# EAGLE schematic untitled (EAGLE 8.6.3)
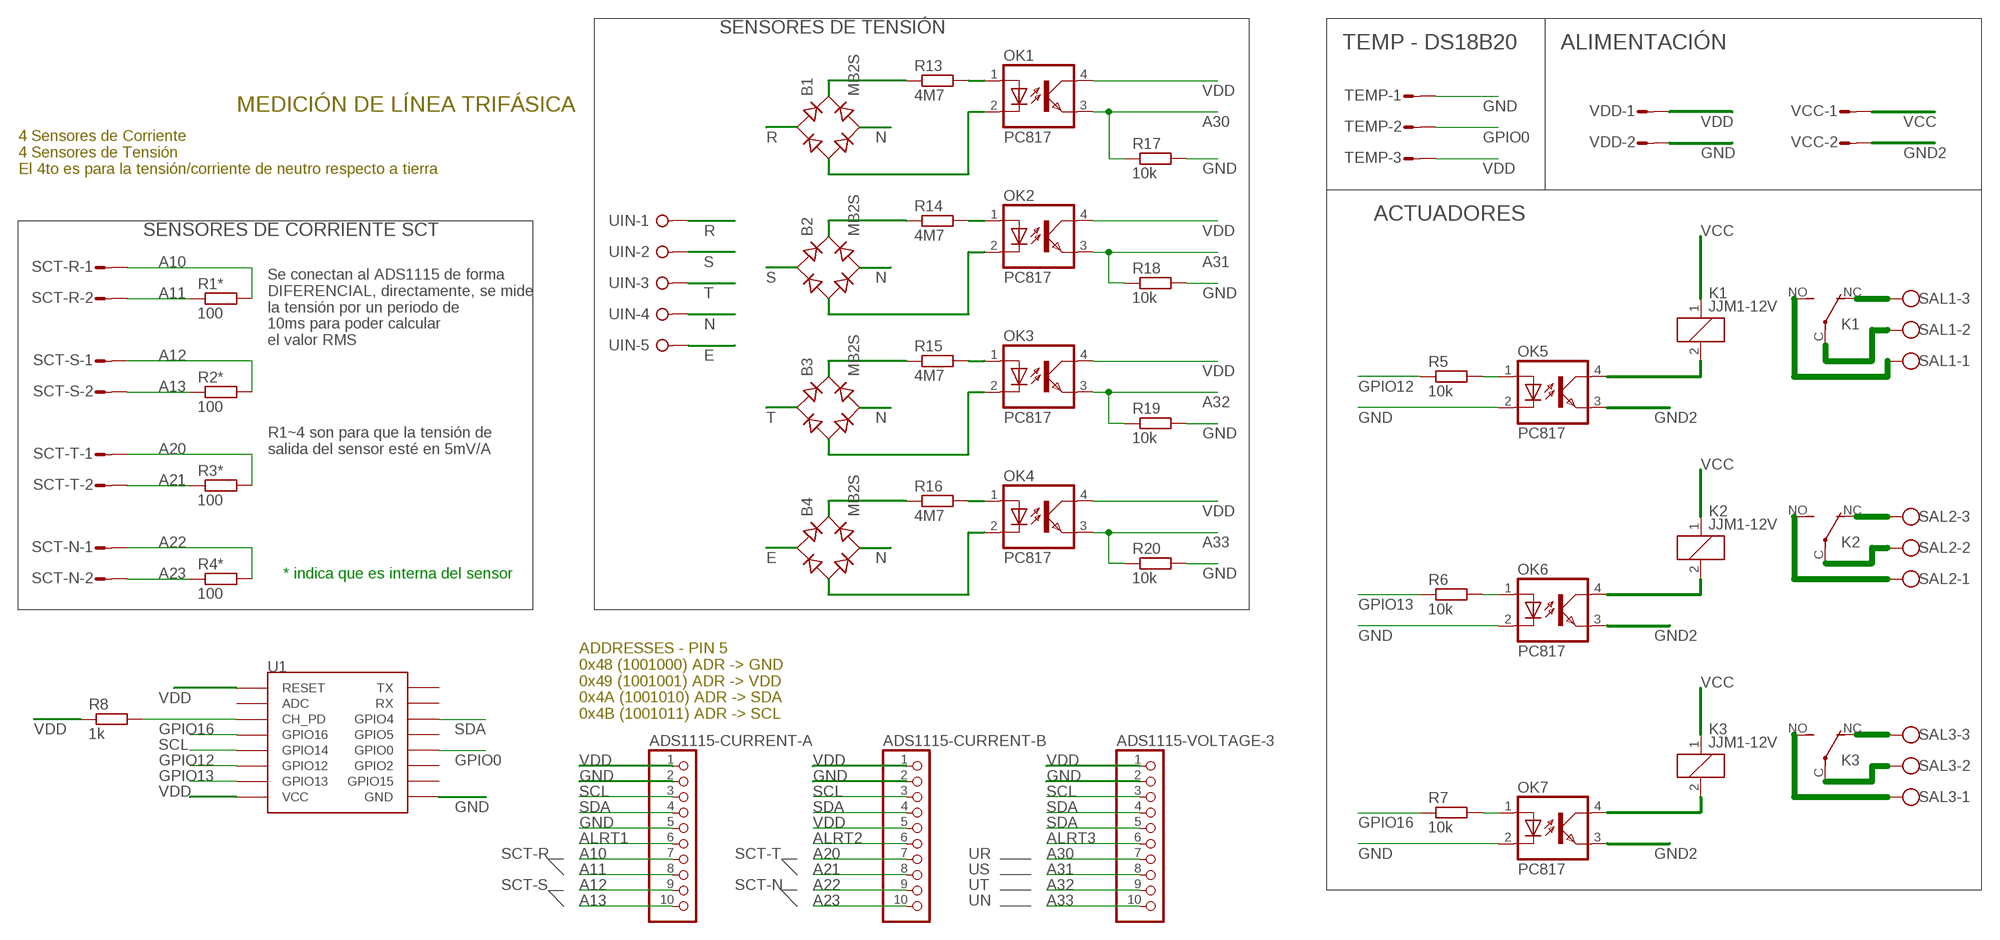
[diagram p0: schematic, sheet 1]

## Parts
ADS1115-CURRENT-A  PINHD-1X10  [1X10]
ADS1115-CURRENT-B  PINHD-1X10  [1X10]
ADS1115-VOLTAGE-3  PINHD-1X10  [1X10]
B1  MB2S  [SOIC-4]
B2  MB2S  [SOIC-4]
B3  MB2S  [SOIC-4]
B4  MB2S  [SOIC-4]
K1  JJM1-12V  [JJM1C]
K2  JJM1-12V  [JJM1C]
K3  JJM1-12V  [JJM1C]
OK1  PC817  [DIL04]
OK2  PC817  [DIL04]
OK3  PC817  [DIL04]
OK4  PC817  [DIL04]
OK5  PC817  [DIL04]
OK6  PC817  [DIL04]
OK7  PC817  [DIL04]
R1*  100  R-EU_M0805  [M0805]
R2*  100  R-EU_M0805  [M0805]
R3*  100  R-EU_M0805  [M0805]
R4*  100  R-EU_M0805  [M0805]
R5  10k  R-EU_M0805  [M0805]
R6  10k  R-EU_M0805  [M0805]
R7  10k  R-EU_M0805  [M0805]
R8  1k  R-EU_M0805  [M0805]
R13  4M7  R-EU_M0805  [M0805]
R14  4M7  R-EU_M0805  [M0805]
R15  4M7  R-EU_M0805  [M0805]
R16  4M7  R-EU_M0805  [M0805]
R17  10k  R-EU_M0805  [M0805]
R18  10k  R-EU_M0805  [M0805]
R19  10k  R-EU_M0805  [M0805]
R20  10k  R-EU_M0805  [M0805]
SAL1  W237-103  [W237-103]
SAL2  W237-103  [W237-103]
SAL3  W237-103  [W237-103]
SCT-N  S02P  [S02P]
SCT-R  S02P  [S02P]
SCT-S  S02P  [S02P]
SCT-T  S02P  [S02P]
TEMP  S03P  [S03P]
U1  ESP12SMD  [ESP12-SMD]
UIN  W237-05P  [W237-5P]
VCC  S02P  [S02P]
VDD  S02P  [S02P]

## Nets
A10: ADS1115-CURRENT-A.7 R1*.2 SCT-R.1
A11: ADS1115-CURRENT-A.8 R1*.1 SCT-R.2
A12: ADS1115-CURRENT-A.9 R2*.2 SCT-S.1
A13: ADS1115-CURRENT-A.10 R2*.1 SCT-S.2
A20: ADS1115-CURRENT-B.7 R3*.2 SCT-T.1
A21: ADS1115-CURRENT-B.8 R3*.1 SCT-T.2
A22: ADS1115-CURRENT-B.9 R4*.2 SCT-N.1
A23: ADS1115-CURRENT-B.10 R4*.1 SCT-N.2
A30: ADS1115-VOLTAGE-3.7 OK1.3(EMIT) R17.1
A31: ADS1115-VOLTAGE-3.8 OK2.3(EMIT) R18.1
A32: ADS1115-VOLTAGE-3.9 OK3.3(EMIT) R19.1
A33: ADS1115-VOLTAGE-3.10 OK4.3(EMIT) R20.1
ALRT1: ADS1115-CURRENT-A.6
ALRT2: ADS1115-CURRENT-B.6
ALRT3: ADS1115-VOLTAGE-3.6
E: B4.~1(AC1) UIN.5
GND [source]: ADS1115-CURRENT-A.2 ADS1115-CURRENT-A.5 ADS1115-CURRENT-B.2 ADS1115-VOLTAGE-3.2 OK5.2(C) OK6.2(C) OK7.2(C) R17.2 R18.2 R19.2 R20.2 TEMP.1 U1.GND VDD.2
GND2 [source]: OK5.3(EMIT) OK6.3(EMIT) OK7.3(EMIT) VCC.2
GPIO0: TEMP.2 U1.GPIO0
GPIO12: R5.1 U1.GPIO12
GPIO13: R6.1 U1.GPIO13
GPIO16: R7.1 U1.GPIO16
N: B1.~2(AC2) B2.~2(AC2) B3.~2(AC2) B4.~2(AC2) UIN.4
N$1 [power]: K1.C(2:P) SAL1.2
N$2 [power]: K1.NO(2:S) SAL1.1
N$3 [power]: K1.NC(2:O) SAL1.3
N$4: K1.2 OK5.4(COL)
N$5: K2.2 OK6.4(COL)
N$6: K3.2 OK7.4(COL)
N$8: OK5.1(A) R5.2
N$9: OK2.1(A) R14.2
N$10: OK1.1(A) R13.2
N$11: B2.+ R14.1
N$12: B1.+ R13.1
N$13: B1.- OK1.2(C)
N$14: B2.- OK2.2(C)
N$15: OK3.1(A) R15.2
N$16: B3.+ R15.1
N$17: B3.- OK3.2(C)
N$18: OK4.1(A) R16.2
N$19: B4.+ R16.1
N$20: B4.- OK4.2(C)
N$21: R8.2 U1.CH_PD
N$23 [power]: K2.NC(2:O) SAL2.3
N$24 [power]: K2.C(2:P) SAL2.2
N$25 [power]: K2.NO(2:S) SAL2.1
N$26 [power]: K3.C(2:P) SAL3.2
N$27 [power]: K3.NC(2:O) SAL3.3
N$28 [power]: K3.NO(2:S) SAL3.1
N$30: OK6.1(A) R6.2
N$31: OK7.1(A) R7.2
R: B1.~1(AC1) UIN.1
S: B2.~1(AC1) UIN.2
SCL: ADS1115-CURRENT-A.3 ADS1115-CURRENT-B.3 ADS1115-VOLTAGE-3.3 U1.GPIO14
SDA: ADS1115-CURRENT-A.4 ADS1115-CURRENT-B.4 ADS1115-VOLTAGE-3.4 ADS1115-VOLTAGE-3.5 U1.GPIO4
T: B3.~1(AC1) UIN.3
VCC [source]: K1.1 K2.1 K3.1 VCC.1
VDD [source]: ADS1115-CURRENT-A.1 ADS1115-CURRENT-B.1 ADS1115-CURRENT-B.5 ADS1115-VOLTAGE-3.1 OK1.4(COL) OK2.4(COL) OK3.4(COL) OK4.4(COL) R8.1 TEMP.3 U1.RESET U1.VCC VDD.1
Unconnected: U1.ADC U1.GPIO2 U1.GPIO5 U1.GPIO15 U1.RXD0(RX) U1.TXD0(TX)

## Notes on the sheet
- SENSORES DE TENSIÓN
- TEMP - DS18B20 | ALIMENTACIÓN
- MEDICIÓN DE LÍNEA TRIFÁSICA
- 4 Sensores de Corriente
  4 Sensores de Tensión
  El 4to es para la tensión/corriente de neutro respecto a tierra
- ACTUADORES
- SENSORES DE CORRIENTE SCT
- Se conectan al ADS1115 de forma 
  DIFERENCIAL, directamente, se mide
  la tensión por un periodo de
  10ms para poder calcular
  el valor RMS
- R1~4 son para que la tensión de
  salida del sensor esté en 5mV/A
- * indica que es interna del sensor
- ADDRESSES - PIN 5
  0x48 (1001000) ADR -> GND
  0x49 (1001001) ADR -> VDD
  0x4A (1001010) ADR -> SDA
  0x4B (1001011) ADR -> SCL
- SCT-R | SCT-T | UR
- US
- SCT-S | SCT-N | UT
- UN

## Library data of the parts
ADS1115-CURRENT-A ADS1115-CURRENT-B ADS1115-VOLTAGE-3 = pinhead:PINHD-1X10: PIN HEADER
B1-B4 = rectifier:MB*S: Bridge Rectifier Source: http://www.fairchildsemi.com/ds/MB/MB6S.pdf
K1-K3 = relay:JJM1-12V: HALF-SIZE AUTOMOTIVE RELAY NAiS Source: http://www.mew-europe.com/.. en_ds_61210_0001.pdf; MF: AROMAT/ MATSUSHITA; MPN: JJM1-12V; OC_FARNELL: unknown; OC_NEWARK: 10C7318
OK1-OK7 = optocoupler:PC817: SHARP OPTO COUPLER; MPN: PC817X4J000F; OC_FARNELL: 9707727; OC_NEWARK: 97K7059
R1* R2* R3* R4* R5-R8 R13-R20 = rcl:R-EU_: RESISTOR, European symbol; SPICEPREFIX: R
SAL1-SAL3 = con-wago-500:W237-103: WAGO SCREW CLAMP; MPN: 237-103; OC_FARNELL: unknown; OC_NEWARK: 18M7116
SCT-N SCT-R SCT-S SCT-T VCC VDD = con-amp-mt:S02P: AMP MT CONNECTOR; OC_FARNELL: unknown; OC_NEWARK: unknown
TEMP = con-amp-mt:S03P: AMP MT CONNECTOR; OC_FARNELL: unknown; OC_NEWARK: unknown
U1 = esp8266modules:ESP12: ESP8266 Wifi module 12
UIN = con-wago-508:W237-05P: WAGO SREW CLAMP; OC_FARNELL: unknown; OC_NEWARK: unknown

## Net classes
0 default: width 0.5 mm, drill 0.7 mm, clearance 0.5 mm
1 source: width 0.8 mm, drill 0.7 mm, clearance 0.5 mm
2 power: width 3 mm, drill 1 mm, clearance 1 mm